# Altium schematic sheet STPedal_Power.SchDoc
size A4; SheetNumber: 3; SheetTotal: 4
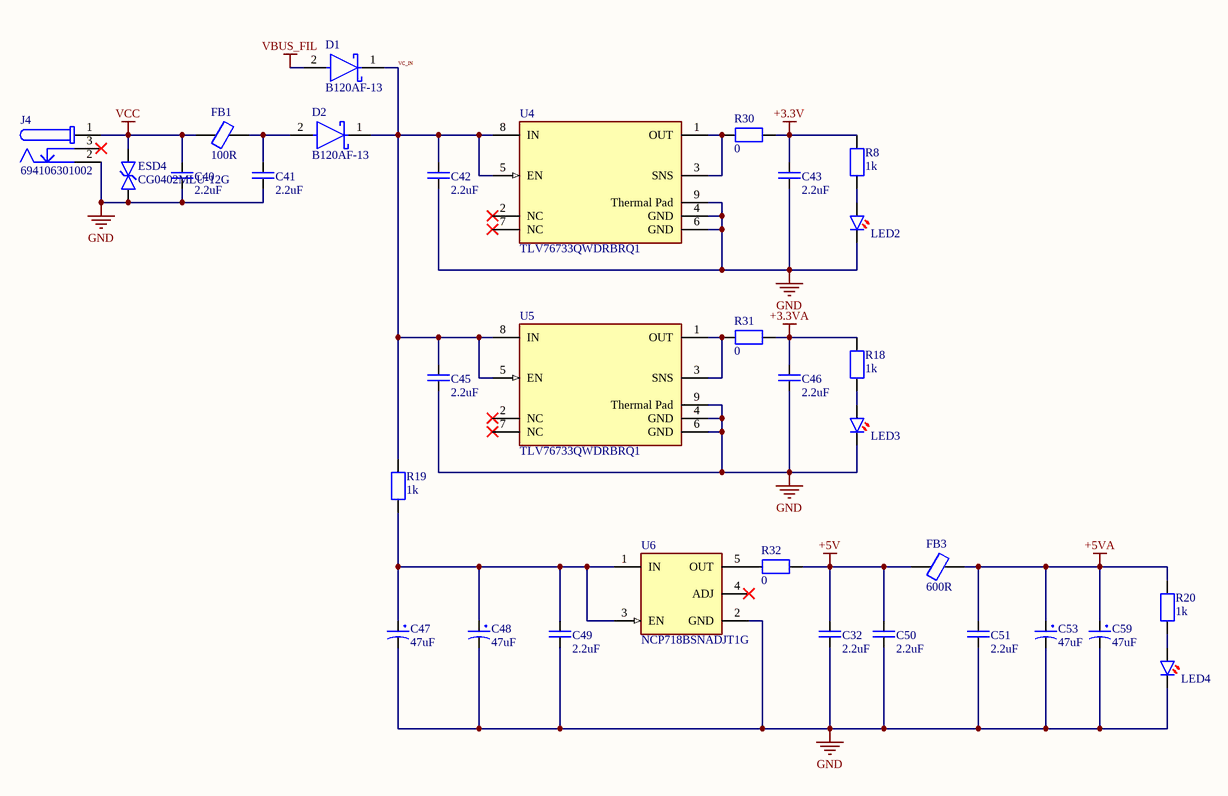
[diagram p0: STPedal_Power.SchDoc]

## Parts
C32  2.2uF  [CAPC_0402_1005X55N]
C40  2.2uF  [CAPC_0402_1005X55N]
C41  2.2uF  [CAPC_0402_1005X55N]
C42  2.2uF  [CAPC_0402_1005X55N]
C43  2.2uF  [CAPC_0402_1005X55N]
C45  2.2uF  [CAPC_0402_1005X55N]
C46  2.2uF  [CAPC_0402_1005X55N]
C47  47uF  [SMD,D6.3xL5.4mm]
C48  47uF  [SMD,D6.3xL5.4mm]
C49  2.2uF  [CAPC_0402_1005X55N]
C50  2.2uF  [CAPC_0402_1005X55N]
C51  2.2uF  [CAPC_0402_1005X55N]
C53  47uF  [SMD,D6.3xL5.4mm]
C59  47uF  [SMD,D6.3xL5.4mm]
D1  B120AF-13  [FP-SMAF-MFG]
D2  B120AF-13  [FP-SMAF-MFG]
ESD4  CG0402MLU-12G  [DIOC_0402_1005X41N]
FB1  100R  [FBC_0805_2012X105N]
FB3  600R  [FBC_0805_2012X105N]
J4  694106301002  [694106301002]
LED2  LED_Red_JLCD_0603  [LED_0603_1608]  (value not drawn)
LED3  LED_Red_JLCD_0603  [LED_0603_1608]  (value not drawn)
LED4  LED_Red_JLCD_0603  [LED_0603_1608]  (value not drawn)
R8  1k  [RESC_0402_1005X40N]
R18  1k  [RESC_0402_1005X40N]
R19  1k  [RESC_0402_1005X40N]
R20  1k  [RESC_0402_1005X40N]
R30  0  [RESC_0402_1005X40N]
R31  0  [RESC_0402_1005X40N]
R32  0  [RESC_0402_1005X40N]
U4  TLV76733QWDRBRQ1  [FP-DRB0008J-IPC_C]
U5  TLV76733QWDRBRQ1  [FP-DRB0008J-IPC_C]
U6  NCP718BSNADJT1G  [FP-419AE-01-IPC_C]

## Nets
+3.3V: C43.2 R8.2 R30.2
+3.3VA: C46.2 R18.2 R31.2
+5V: C32.2 C50.2 FB3.1 R32.2
+5VA: C51.2 C53.1 C59.1 FB3.2 R20.1
GND: C32.1 C40.1 C41.1 C42.1 C43.1 C45.1 C46.1 C47.2 C48.2 C49.1 C50.1 C51.1 C53.2 C59.2 ESD4.1 J4.2 LED2.2 LED3.2 LED4.2 U4.4(GND) U4.6(GND) U4.9(Thermal_Pad) U5.4(GND) U5.6(GND) U5.9(Thermal_Pad) U6.2(GND)
VBUS_FIL: D1.2(A)
VCC: C40.2 ESD4.2 FB1.1 J4.1
VC_IN: C42.2 C45.2 D1.1(C) D2.1(C) R19.2 U4.5(EN) U4.8(IN) U5.5(EN) U5.8(IN)
NetC41_2: C41.2 D2.2(A) FB1.2
NetC47_1: C47.1 C48.1 C49.2 R19.1 U6.1(IN) U6.3(EN)
NetLED2_1: LED2.1 R8.1
NetLED3_1: LED3.1 R18.1
NetLED4_1: LED4.1 R20.2
NetR30_1: R30.1 U4.1(OUT) U4.3(SNS)
NetR31_1: R31.1 U5.1(OUT) U5.3(SNS)
NetR32_1: R32.1 U6.5(OUT)

Not connected (* = marked no-connect by the designer): J4 3*; U4 2(NC)* 7(NC)*; U5 2(NC)* 7(NC)*; U6 4(ADJ)*

## Library data of the parts
C32 C40-C43 C45 C46 C49-C51 = 2.2uF_CAP_0402: Capacitor 0402 - 2.2uF +-/10% / 25V; Manufacturer: Samsung Electro-Mechanics; MPN: CL05A225MQ5NSNC; LCSC: C12530
C47 C48 C53 C59 = 47uF_JLCAP_Elect_D6.3mm: -55℃~+105℃ 2000hrs@105℃ 35V 47uF 5.4mm 6.3mm ±20% SMD,D6.3xL5.4mm Aluminum Electrolytic Capacitors - SMD ROHS; Manufactuer: Honor Elec; MPN: RVT1V470M0605; LCSC: C3344
D1 D2 = CMP-12790-000092-1: DIODE SCHOTTKY 20V 1A SMAF; Average Rectified Current: 1A; Packaging: Tape and Reel; Mount: Surface Mount; Max Reverse Voltage (DC): 20V; RoHS Compliant: Yes; LCSC: C5125499
ESD4 = CG0402MLU-12G: -40℃~+125℃ 0.05pF 1 12V 25V 5nA ESD IEC 61000-4-2 0402 ESD and Surge Protection (TVS/ESD) ROHS; Manufacturer: BOURNS; MPN: CG0402MLU-12G; LCSC: C2655716
FB1 FB3 = 600@100MHz_JLCFB_0805: -55℃~+125℃ 1 300mΩ 500mA 600Ω@100MHz ±25% 0805 Ferrite Beads ROHS; Manufacturer: Sunlord; MPN: GZ2012D601TF; LCSC: C1017
J4 = CMP-1502-00188-3: DC Power Jack Connector WR-DC, Male, Right Angled, THT, 5 A, 24 V; Operating Supply Voltage: 24V; Shielding: Unshielded; Current Rating: 5A; Number of Contacts: 3; Insulation Resistance: 100MΩ; Termination: Through Hole; RoHS: Compliant; Contact Plating: Tin; Connector Type: Power; Contact Material: Gold, Tin; Packaging: Bulk; Min Operating Temperature: -40°C; REACH SVHC: Unknown; Housing Material: Polyamide; Contact Gender: Female; Height: 11mm; Gender: Male; Color: Black; Voltage Rating: 24V; Flammability Rating: UL94 V-0; Max Operating Temperature: 85°C; Mount: Through Hole; LCSC: C5441017
LED2-LED4 = LED_Red_JLCD_0603: -40℃~+85℃ 1.8V~2.4V 120° 20mA 300mcd 40mW 615nm~630nm 645nm Discrete Diode Red Water Clear 0603 LED Indication - Discrete ROHS; Manufacturer: Hubei KENTO Elec; MPN: KT-0603R; LCSC: C2286
R8 R18 R20 = 1k_JLCRES-0402: Resistor 0402 - 1k; Manufacturer: UNI-ROYAL(Uniroyal Elec); MPN: 0402WGF1001TCE; LCSC: C11702
R19 = 100R_JLCRES-0402: Resistor 0402 - 100R; Manufacturer: *; MPN: *; LCSC: C25076
R30-R32 = 0R_JLCRES-0402: -55℃~+155℃ 0Ω 50V 62.5mW Thick Film Resistor ±1% ±800ppm/℃ 0402 Chip Resistor - Surface Mount ROHS; Manufacturer: UNI-ROYAL(Uniroyal Elec); MPN: 0402WGF0000TCE; LCSC: C17168
U4 U5 = CMP-04917-000370-1: IC OPAMP; RoHS Compliant: Yes
U6 = CMP-07128-000004-1: -40℃~+125℃@(Tj) 1 24V 250mV@(300mA) 300mA 36uVrms 4uA 5V 60dB@(1kHz) Fixed Over Current Protection、Over Temperature Protection、Enable Positive TSOT-23-5 Voltage Regulators - Linear, Low Drop Out (LDO) Regulators ROHS; Manufacturer Part Number: NCP718BSN500T1G; Manufacturer: On Semiconductor; Min Supply Voltage: 2.5V; Max Junction Temp: +125°C; Nominal Supply Current: 50-300uA; Dropout Voltage: 480mV; Accuracy Percentage: 2%; Standoff Height: 0.01mm; Number Of Outputs: 1; Max Supply Voltage: 24V; Output Type: Fixed; Lead Free: Yes; Temperature: to +125°C; ComponentLink2URL: https://www.onsemi.com/pub/Collateral/NCP718-D.PDF; Height: 1mm; ComponentLink2Description: Datasheet; Octopart: https://octopart.com/ncp718bsnadjt1g-on+semiconductor-87658781; Device Class L1: Integrated Circuits (ICs); Device Class L2: Power Management ICs; Output Voltage: 5V; Device Class L3: Voltage Regulators - Linear; Digikey Description: IC REG LINEAR 5V 300MA TSOT-23-5; Temperature Range High: +125°C; Package: 419AE-01; Output Current: 300mA; Mouser Description: LDO Regulator, 300 mA, Wide Vin, Ultra-Low Iq Adjustable, Non-Active Discharge, TSOT23-5; Category: IC; Automotive: No; RoHS: TRUE; LCSC: C892796